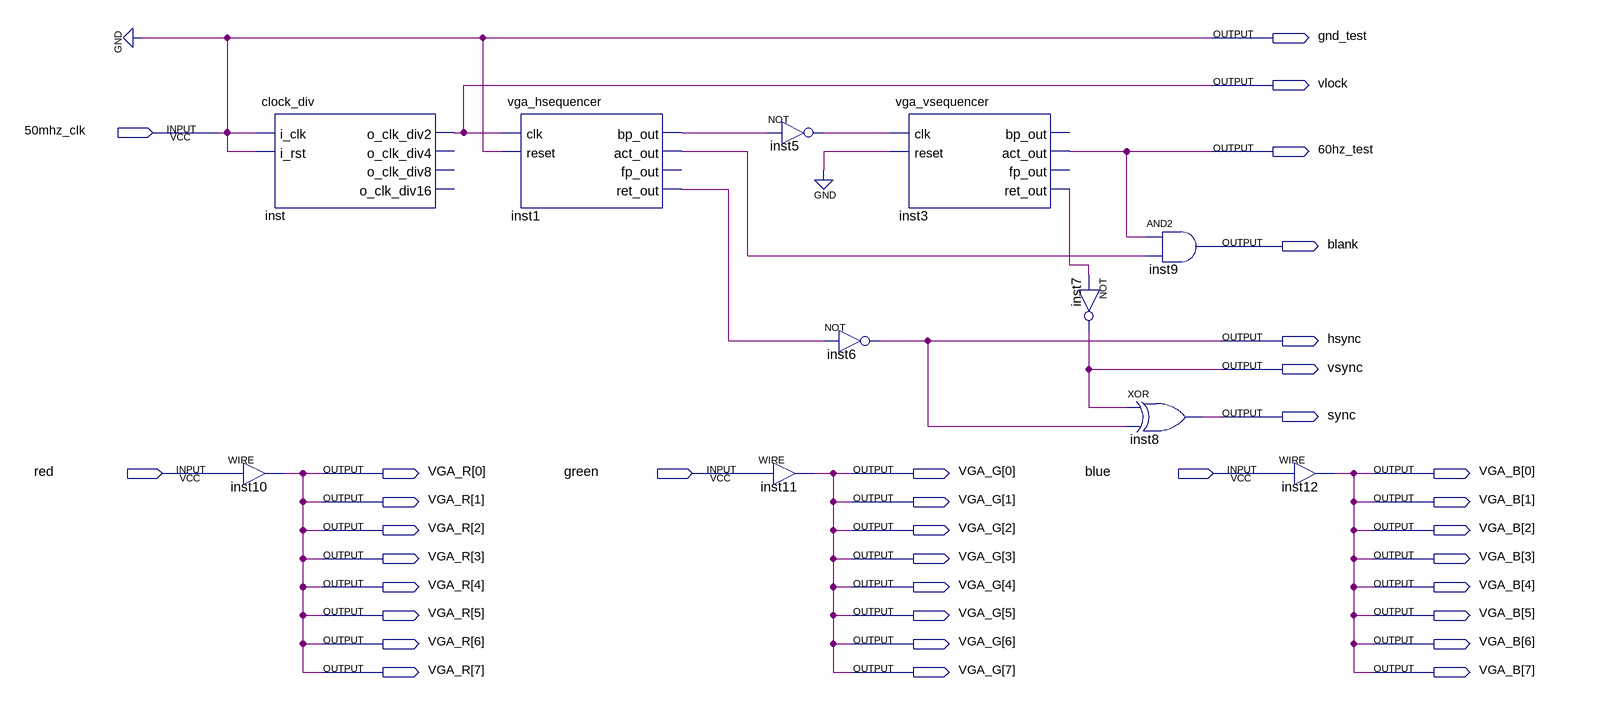
[diagram p0: schematic sheet]
// Quartus schematic vga_timing.bdf as structural Verilog: 11 symbols, 35 pins
module vga_timing (
  input  \50mhz_clk ,
  input  red,
  input  green,
  input  blue,
  output gnd_test,
  output vlock,
  output \60hz_test ,
  output blank,
  output hsync,
  output vsync,
  output sync,
  output [7:0] VGA_R,
  output [7:0] VGA_G,
  output [7:0] VGA_B
);

  wire inst1_act_out, inst1_bp_out, inst1_ret_out, inst3_ret_out, inst5_out;

  assign VGA_R[7] = red;  // WIRE inst10
  clock_div inst (
    .i_clk(\50mhz_clk ), .i_rst(\50mhz_clk ), .o_clk_div2(vlock));  // open: o_clk_div4, o_clk_div8, o_clk_div16
  vga_hsequencer inst1 (
    .clk(vlock), .reset(\50mhz_clk ), .bp_out(inst1_bp_out), .act_out(inst1_act_out), .ret_out(inst1_ret_out));  // open: fp_out
  not inst5 (inst5_out, inst1_bp_out);
  assign VGA_G[7] = green;  // WIRE inst11
  not inst6 (hsync, inst1_ret_out);
  vga_vsequencer inst3 (
    .clk(inst5_out), .reset(1'b0), .act_out(\60hz_test ), .ret_out(inst3_ret_out));  // open: bp_out, fp_out
  not inst7 (vsync, inst3_ret_out);
  and inst9 (blank, \60hz_test , inst1_act_out);
  xor inst8 (sync, vsync, hsync);
  assign VGA_B[7] = blue;  // WIRE inst12

  assign gnd_test = \50mhz_clk ;
  assign VGA_B[6:0] = {7{VGA_B[7]}};
  assign VGA_G[6:0] = {7{VGA_G[7]}};
  assign VGA_R[6:0] = {7{VGA_R[7]}};
  // also tied to GND on the sheet: \50mhz_clk 
endmodule
